# Altium project powerBus.PrjPcb
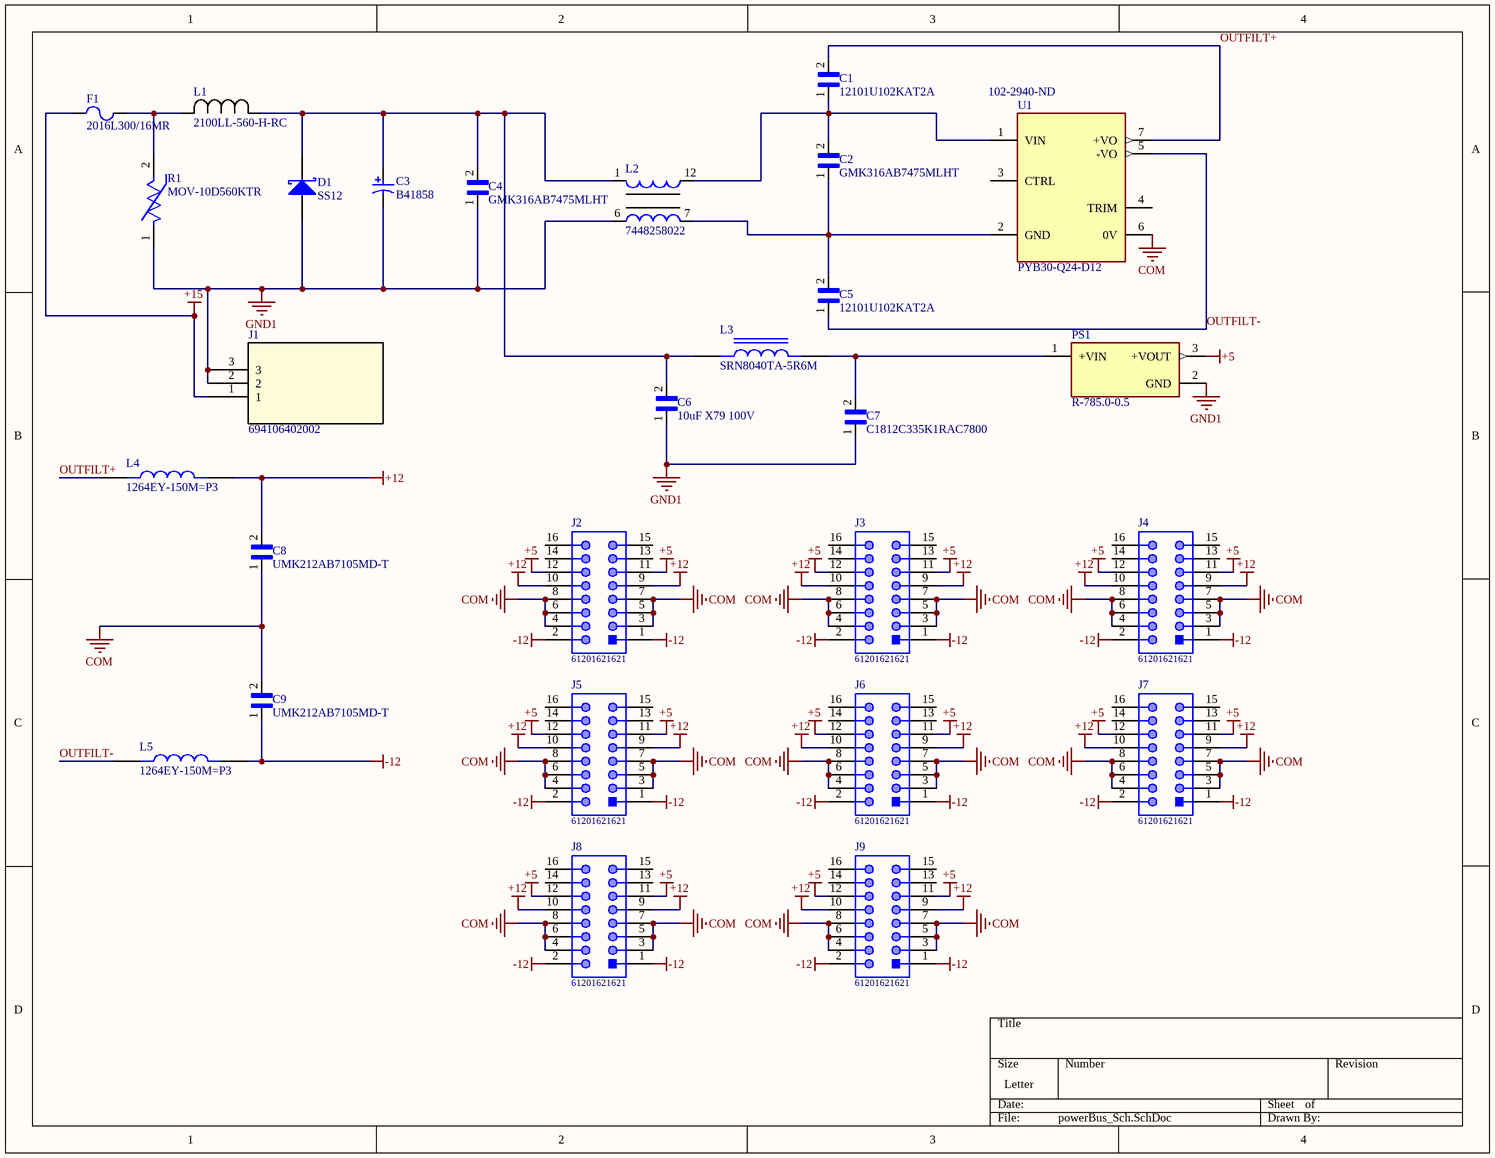
[diagram p0: powerBus_Sch.SchDoc]
1 sheet, 28 parts. Net scope: global (net labels, ports and power ports of the same name join across sheets).
Board file: PCB1.PcbDoc

## Sheet powerBus_Sch.SchDoc
size Letter; SheetNumber: 1; SheetTotal: 1

### Parts
C1  12101U102KAT2A  [CAPC3224X140N]
C2  GMK316AB7475MLHT  [CAPC3216X180N]
C3  B41858  [CAPPR65-350-1150X800X1250]
C4  GMK316AB7475MLHT  [CAPC3216X180N]
C5  12101U102KAT2A  [CAPC3224X140N]
C6  10uF X79 100V  [CAPC5750X330N]
C7  C1812C335K1RAC7800  [CAPC4532X210N]
C8  UMK212AB7105MD-T  [CAPC2013X95N]
C9  UMK212AB7105MD-T  [CAPC2013X95N]
D1  SS12  [FAIR-DO-214AC-2_V]
F1  2016L300/16MR  [LFUS-2016L050MR_V]
J1  694106402002  [DC_JACK]
J2  61201621621  [61201621621]
J3  61201621621  [61201621621]
J4  61201621621  [61201621621]
J5  61201621621  [61201621621]
J6  61201621621  [61201621621]
J7  61201621621  [61201621621]
J8  61201621621  [61201621621]
J9  61201621621  [61201621621]
L1  2100LL-560-H-RC  [IND_2100LL_34_H]
L2  7448258022  [WE-CMB-XL]
L3  SRN8040TA-5R6M  [IND_SRN8040TA-5R6M]
L4  1264EY-150M=P3  [IND_1264EY-150M=P3]
L5  1264EY-150M=P3  [IND_1264EY-150M=P3]
PS1  R-785.0-0.5  [CONV_R-785.0-0.5]
R1  MOV-10D560KTR  [FP-MOV-10D201KTR-MFG]
U1  PYB30-Q24-D12  Supplier Part Number 1: 102-2940-ND  [CONV_PYB30-Q24-D12]

### Nets
+5: J2.11 J2.12 J3.11 J3.12 J4.11 J4.12 J5.11 J5.12 J6.11 J6.12 J7.11 J7.12 J8.11 J8.12 J9.11 J9.12 PS1.3(+VOUT)
+12: C8.2 J2.9 J2.10 J3.9 J3.10 J4.9 J4.10 J5.9 J5.10 J6.9 J6.10 J7.9 J7.10 J8.9 J8.10 J9.9 J9.10 L4.2
+15: F1.1 J1.1
-12: C9.1 J2.1 J2.2 J3.1 J3.2 J4.1 J4.2 J5.1 J5.2 J6.1 J6.2 J7.1 J7.2 J8.1 J8.2 J9.1 J9.2 L5.2
COM: C8.1 C9.2 J2.3 J2.4 J2.5 J2.6 J2.7 J2.8 J3.3 J3.4 J3.5 J3.6 J3.7 J3.8 J4.3 J4.4 J4.5 J4.6 J4.7 J4.8 J5.3 J5.4 J5.5 J5.6 J5.7 J5.8 J6.3 J6.4 J6.5 J6.6 J6.7 J6.8 J7.3 J7.4 J7.5 J7.6 J7.7 J7.8 J8.3 J8.4 J8.5 J8.6 J8.7 J8.8 J9.3 J9.4 J9.5 J9.6 J9.7 J9.8 U1.6(0V)
GND1: C3.2 C4.1 C6.1 C7.1 D1.1(A) J1.2 J1.3 L2.6 PS1.2(GND) R1.1
OUTFILT+: C1.2 L4.1 U1.7(+VO)
OUTFILT-: C5.1 L5.1 U1.5(-VO)
NetC1_1: C1.1 C2.2 L2.12 U1.1(VIN)
NetC2_1: C2.1 C5.2 L2.7 U1.2(GND)
NetC3_1: C3.1 C4.2 C6.2 D1.2(K) L1.1 L2.1 L3.1
NetC7_2: C7.2 L3.2 PS1.1(+VIN)
NetF1_2: F1.2 L1.2 R1.2

Not connected (* = marked no-connect by the designer): J2 13 14 15 16; J3 13 14 15 16; J4 13 14 15 16; J5 13 14 15 16; J6 13 14 15 16; J7 13 14 15 16; J8 13 14 15 16; J9 13 14 15 16; U1 3(CTRL) 4(TRIM)

### Library data of the parts
C1 C5 = 12101U102KAT2A: 1210 1 nF 100 V Â±10 % Tolerance SMT Ultra Low ESR RF/Microwave Capacitor; Package: None; Price: None; Value: *; MP: 12101U102KAT2A; Availability: Unavailable
C2 C4 = GMK316AB7475MLHT: 0; Package: None; Price: None; Value: *; MP: GMK316AB7475MLHT; Availability: Unavailable
C3 = CMP-1665-00041-1: Aluminum Electrolytic Capacitor, 120uF; Data Rate: 54 mbps; Nominal Supply Voltage: 3.3 V; Case\Package: QFN; Packaging: Tape and Reel; PackageDescription: 2-Pin Radial Lead, Dia 8 mm, Body Length 11.5 mm; PackageReference: CAPPR65-350-1150X800X1250; Max Operating Temperature: 70 degC; RoHSCompliant: true; Length: 7.7 mm; Min Operating Temperature: -20 degC; DatasheetVersion: Mar-16; Mount: Surface Mount; Pins: 48; Radiation Hardening: No; Package Quantity: 500; ComponentLink1Description: Digikey; ComponentLink1URL: https://www.digikey.com/en/products/detail/epcos-tdk-electronics/B41858C7127M000/3543602
C6 = C1812C335K1RAC7800: Package: None; Price: None; Value: *; MP: C1812C335K1RAC7800; Availability: Unavailable
C8 C9 = UMK212AB7105MD-T: CAP ,MLCC ,0805,50V ,X7R,1.0UF20% ,T&R; Package: None; Price: None; Value: *; MP: UMK212AB7105MD-T; Availability: Unavailable
D1 = CMP-004-00016-2: Schottky Rectifier, 20 V, 1 A, -65 to 125 degC, 2-Pin DO-214AC, RoHS, Tape and Reel; Manufacturer: Fairchild; Forward Voltage: 500mV; Peak Reverse Current: 200uA; Max Surge Current: 40A; Min Operating Temperature: -65°C; Packaging: TapeandReel; Datasheet URL: https://www.fairchildsemi.com/datasheets/SS/SS12.pdf; Datasheet Version: Rev. 1.9, 01/2015; Package URL: https://www.fairchildsemi.com/package-drawings/DO/DO214AC.pdf; Package Description: 2-Pin Surface Mount Device, Body 4.375 x 2.725 mm; Manufacturer URL: https://www.fairchildsemi.com/; Mounting Technology: SM; Case/Package: SMA; RoHS Compliant: True; Package Quantity: 7500; Pins: 2; Max Operating Temperature: 125°C; Package Reference: DO-214AC-2
F1 = CMP-2000-05524-1: Poly-Fuse(R) Resettable PTC, 60 V, 20 A, -40 to 85 degC, 2-Pin SMD, RoHS, Tape and Reel; Current Rating - Max: 20A; Type: PolyFuseResettablePTC; Resistance: 1Ohms; Trip Current: 1.1A; Brand: Littelfuse; Hold Current: 0.55A; Maximum Voltage: 60VDC; Maximum Voltage DC: 60V; RoHS: Details; Product Category: ResettableFuses-PPTC; Manufacturer URL: http://www.littelfuse.com/; Series: 2016L; Datasheet Version: 08/2016; Package Reference: 2016L050MR; Package Description: 2-Pin Surface Mount Device, Body 5.08 x 4.065 mm; Dimensions: 4.72mmLx3.7mmWx1.2mmH; Operating Temperature Range: -40Cto+85C; Termination Style: SMD/SMT; Mounting Style: SMD/SMT; Manufacturer: Littelfuse; Datasheet URL: http://www.littelfuse.com/~/media/electronics/datasheets/resettable_ptcs/littelfuse_ptc_2016l_datasheet.pdf.pdf; Current Rating: 20A; Package / Case: 2016(5041metric); Current Rating (Max): 20A; Packaging: Reel; Mounting Technology: SurfaceMount; Factory Pack Quantity: 1000
J1 = 694106402002: No Description Available; Mfr_Name: Wurth Electronics; Copyright: Copyright (C) 2022 Ultra Librarian. All rights reserved.; Manufacturer_Part_Number: 694106402002; Digi-Key_Part_Number_1: 732-5931-ND; RefDes: RefDes; Type: DEV
J2-J9 = CMP-1502-00009-1: Male Box Header WR-BHD, THT, Vertical, pitch 2.54 mm, 16 pins; Manufacturer: Wurth Elektronik; Pin Number: 16; Pitch: 2.54mm; Contact Resistance: 20mOhm; Working Voltage: 250VAC; Withstanding Voltage: 500VAC; Published Date: August2018; Gender: Male; Package Reference: 61201621621; Mounting Technology: THT; Part Number: 61201621621; Datasheet URL: https://katalog.we-online.de/em/datasheet/6120xx21621.pdf; Orientation: Vertical; Operating Temperature: -40to125degC; Manufacturer URL: http://www.we-online.de; Publisher: WurthElektronik; Packaging: Tray
L1 = 2100LL-560-H-RC: No Description Available; Mfr_Name: Bourns Electronics; Type: DEV; Copyright: Copyright (C) 2022 Ultra Librarian. All rights reserved.; Manufacturer_Part_Number: 2100LL-560-H-RC; Digi-Key_Part_Number_1: M1409-ND; RefDes: RefDes
L2 = CMP-0223-00067-1: THT Common Mode Power Line Choke WE-CMB, L = 2.20 mH; Inductance: 2.20 mH; ComponentLink1Description: Manufacturer Link; ComponentLink2Description: Datasheet; PackageVersion: 2004; PackageReference: WE-CMB-XL; PackageDescription: THT Inductor, 4-Leads, Body 30.0 x 21.0 mm; ComponentLink1URL: http://www.we-online.com; ComponentLink2URL: http://www.we-online.de/katalog/media/pdf/7448258022.pdf; DatasheetVersion: ver 4, Oct-2004
L3 = SRN8040TA-5R6M: Inductor Power Semi-Shielded Wirewound 150uH 20% 1MHz 10Q-Factor Ferrite 980mA 410mOhm DCR 3131 Automotive T/R; Value: 5.6uH; Package: None; Price: None; MP: SRN8040TA-5R6M; Availability: Unavailable
L4 L5 = 1264EY-150M=P3: Inductor Power Shielded Wirewound 22uH 20% 100KHz Ferrite 1.8A 132mOhm DCR 2424 T/R; Package: None; Price: None; Value: *; MP: 1264EY-150M=P3; Availability: Unavailable
PS1 = R-785.0-0.5: 0.5A DC/DC-Converter 'INNOLINE' SIP3 reg; MF: Recom Power; Value: *; Availability: Unavailable; Price: None; Package: SIP-3 Recom Power; MP: R-785.0-0.5; SnapEDA_Link: https://www.snapeda.com/parts/R-785.0-0.5/Recom%20Power/view-part/331228/?ref=snap
R1 = CMP-07402-000009-1: VARISTOR 200V 2.5KA DISC 10MM; Manufacturer: Bourns Inc.; Manufacturer Part Number: MOV-10D201KTR; Voltage Rating Ac: 130V; Varistor Voltage: 185V; Voltage Rating Dc: 170V; Voltage Tolerance: 10%; Clamping Voltage: 340V; Capacitance: 600pF; Clamping Current: 25A; Value: 600pF; Device Class L2: Varistors; Automotive: No; Octopart: https://octopart.com/mov-10d201ktr-bourns-19184757; Temperature: -40°C to +105°C; RoHS: TRUE; Height: 15.5mm; Category: Res; Mouser Description: Varistors 250pF 200volts 10%; Lead Free: Yes; ComponentLink2Description: Datasheet; ComponentLink2URL: https://www.bourns.com/docs/Product-Datasheets/MOV10D.pdf; Temperature Range High: +105°C; Device Class L3: unset; Temperature Range Low: -40°C; Package: 0; Digikey Description: VARISTOR 200V 2.5KA DISC 10MM; Device Class L1: Circuit Protection
U1 = PYB30-Q24-D12: 12/-12 Vdc, 1.25 A, 30 W, 9~36 Vdc Input Range; Package: None; Price: None; Value: *; MP: PYB30-Q24-D12; Availability: Unavailable; Supplier 1: Digi-Key
C7 = C1812C335K1RAC7800: Package: None; Price: None; Value: *; MP: C1812C335K1RAC7800; Availability: Unavailable